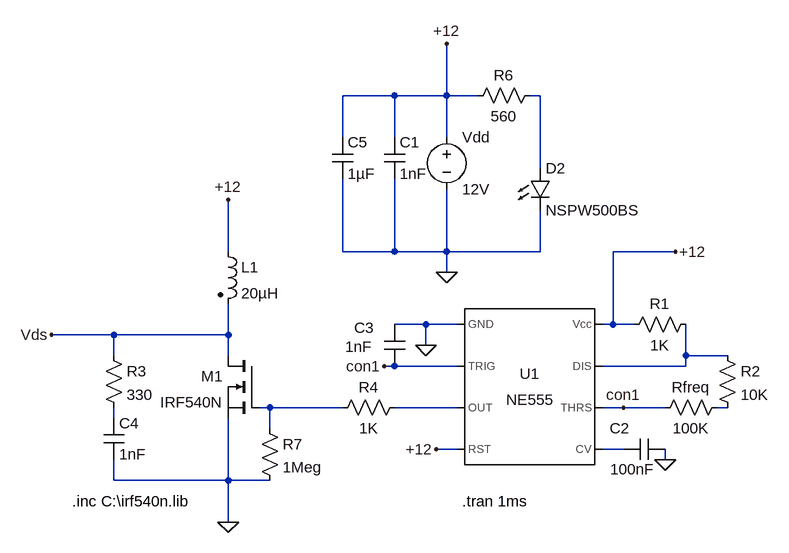
[diagram p0: schematic 555FBT driver.asc]
555FBT driver.asc, the LTspice schematic file:
Version 4
SHEET 1 2204 724
WIRE 400 -448 320 -448
WIRE 480 -448 480 -528
WIRE 480 -448 400 -448
WIRE 528 -448 480 -448
WIRE 624 -448 608 -448
WIRE 320 -384 320 -448
WIRE 400 -384 400 -448
WIRE 480 -384 480 -448
WIRE 624 -336 624 -448
WIRE 144 -208 144 -288
WIRE 320 -208 320 -320
WIRE 400 -208 400 -320
WIRE 400 -208 320 -208
WIRE 480 -208 480 -304
WIRE 480 -208 400 -208
WIRE 624 -208 624 -272
WIRE 624 -208 480 -208
WIRE 832 -208 736 -208
WIRE 480 -176 480 -208
WIRE 448 -96 400 -96
WIRE 496 -96 448 -96
WIRE 736 -96 736 -208
WIRE 736 -96 720 -96
WIRE 768 -96 736 -96
WIRE -32 -80 -128 -80
WIRE 144 -80 144 -128
WIRE 144 -80 -32 -80
WIRE 448 -64 448 -96
WIRE -32 -48 -32 -80
WIRE 144 -48 144 -80
WIRE 848 -48 848 -96
WIRE 912 -48 848 -48
WIRE 400 -32 384 -32
WIRE 496 -32 400 -32
WIRE 848 -32 848 -48
WIRE 848 -32 720 -32
WIRE 208 32 192 32
WIRE 320 32 208 32
WIRE 496 32 400 32
WIRE 752 32 720 32
WIRE 816 32 752 32
WIRE 912 32 896 32
WIRE -32 48 -32 32
WIRE 208 64 208 32
WIRE 496 96 464 96
WIRE 752 96 720 96
WIRE 816 112 816 96
WIRE -32 144 -32 112
WIRE 144 144 144 48
WIRE 144 144 -32 144
WIRE 208 144 144 144
WIRE 144 208 144 144
FLAG 480 -528 +12
FLAG 480 -176 0
FLAG 448 -64 0
FLAG 384 -32 con1
FLAG 816 112 0
FLAG 464 96 +12
FLAG 832 -208 +12
FLAG 752 32 con1
FLAG 144 208 0
FLAG 144 -288 +12
FLAG -128 -80 Vds
SYMBOL voltage 480 -400 R0
WINDOW 123 0 0 Left 0
WINDOW 39 0 0 Left 0
SYMATTR InstName Vdd
SYMATTR Value 12V
SYMBOL Misc\\NE555 608 0 R0
SYMATTR InstName U1
SYMBOL cap 816 80 R90
WINDOW 0 -1 70 VBottom 2
WINDOW 3 31 50 VTop 2
SYMATTR InstName C2
SYMATTR Value 100nF
SYMBOL cap 384 -96 R0
WINDOW 0 -46 5 Left 2
WINDOW 3 -60 34 Left 2
SYMATTR InstName C3
SYMATTR Value 1nF
SYMBOL res 864 -112 R90
WINDOW 0 0 56 VBottom 2
WINDOW 3 32 56 VTop 2
SYMATTR InstName R1
SYMATTR Value 1K
SYMBOL res 912 16 R90
WINDOW 0 0 56 VBottom 2
WINDOW 3 32 56 VTop 2
SYMATTR InstName Rfreq
SYMATTR Value 100K
SYMBOL res 896 -64 R0
SYMATTR InstName R2
SYMATTR Value 10K
SYMBOL nmos 192 -48 M0
SYMATTR InstName M1
SYMATTR Value IRF540N
SYMATTR Prefix X
SYMBOL res 416 16 R90
WINDOW 0 0 56 VBottom 2
WINDOW 3 32 56 VTop 2
SYMATTR InstName R4
SYMATTR Value 1K
SYMBOL ind2 128 -224 R0
SYMATTR InstName L1
SYMATTR Value 20µH
SYMATTR Type ind
SYMATTR SpiceLine Rser=1
SYMBOL res -48 -64 R0
SYMATTR InstName R3
SYMATTR Value 330
SYMBOL cap -48 48 R0
SYMATTR InstName C4
SYMATTR Value 1nF
SYMBOL res 624 -464 R90
WINDOW 0 0 56 VBottom 2
WINDOW 3 32 56 VTop 2
SYMATTR InstName R6
SYMATTR Value 560
SYMBOL LED 608 -336 R0
SYMATTR InstName D2
SYMATTR Value NSPW500BS
SYMBOL cap 384 -384 R0
SYMATTR InstName C1
SYMATTR Value 1nF
SYMBOL cap 304 -384 R0
SYMATTR InstName C5
SYMATTR Value 1µF
SYMBOL res 192 48 R0
SYMATTR InstName R7
SYMATTR Value 1Meg
TEXT 504 176 Left 2 !.tran 1ms
TEXT -96 176 Left 2 !.inc C:\\irf540n.lib

The netlist it stands for:
* 555FBT driver.asc
Vdd +12 0 12V
XU1 0 con1 N004 +12 N007 con1 N002 +12 NE555  ; pins GND TRIG OUT RST CV THRS DIS Vcc
C2 0 N007 100nF
C3 0 con1 1nF
R1 N002 +12 1K
Rfreq N005 con1 100K
R2 N002 N005 10K
XM1 Vds N003 0 IRF540N  ; pins D G S
R4 N004 N003 1K
L1 +12 Vds 20µH Rser=1
R3 Vds N006 330
C4 N006 0 1nF
R6 N001 +12 560
D2 N001 0 NSPW500BS
C1 +12 0 1nF
C5 +12 0 1µF
R7 N003 0 1Meg
.model D D
.lib standard.dio
.tran 1ms
.inc C:\irf540n.lib
.lib NE555.sub
.backanno
.end